# EAGLE design schematic_final (EAGLE 6.1)
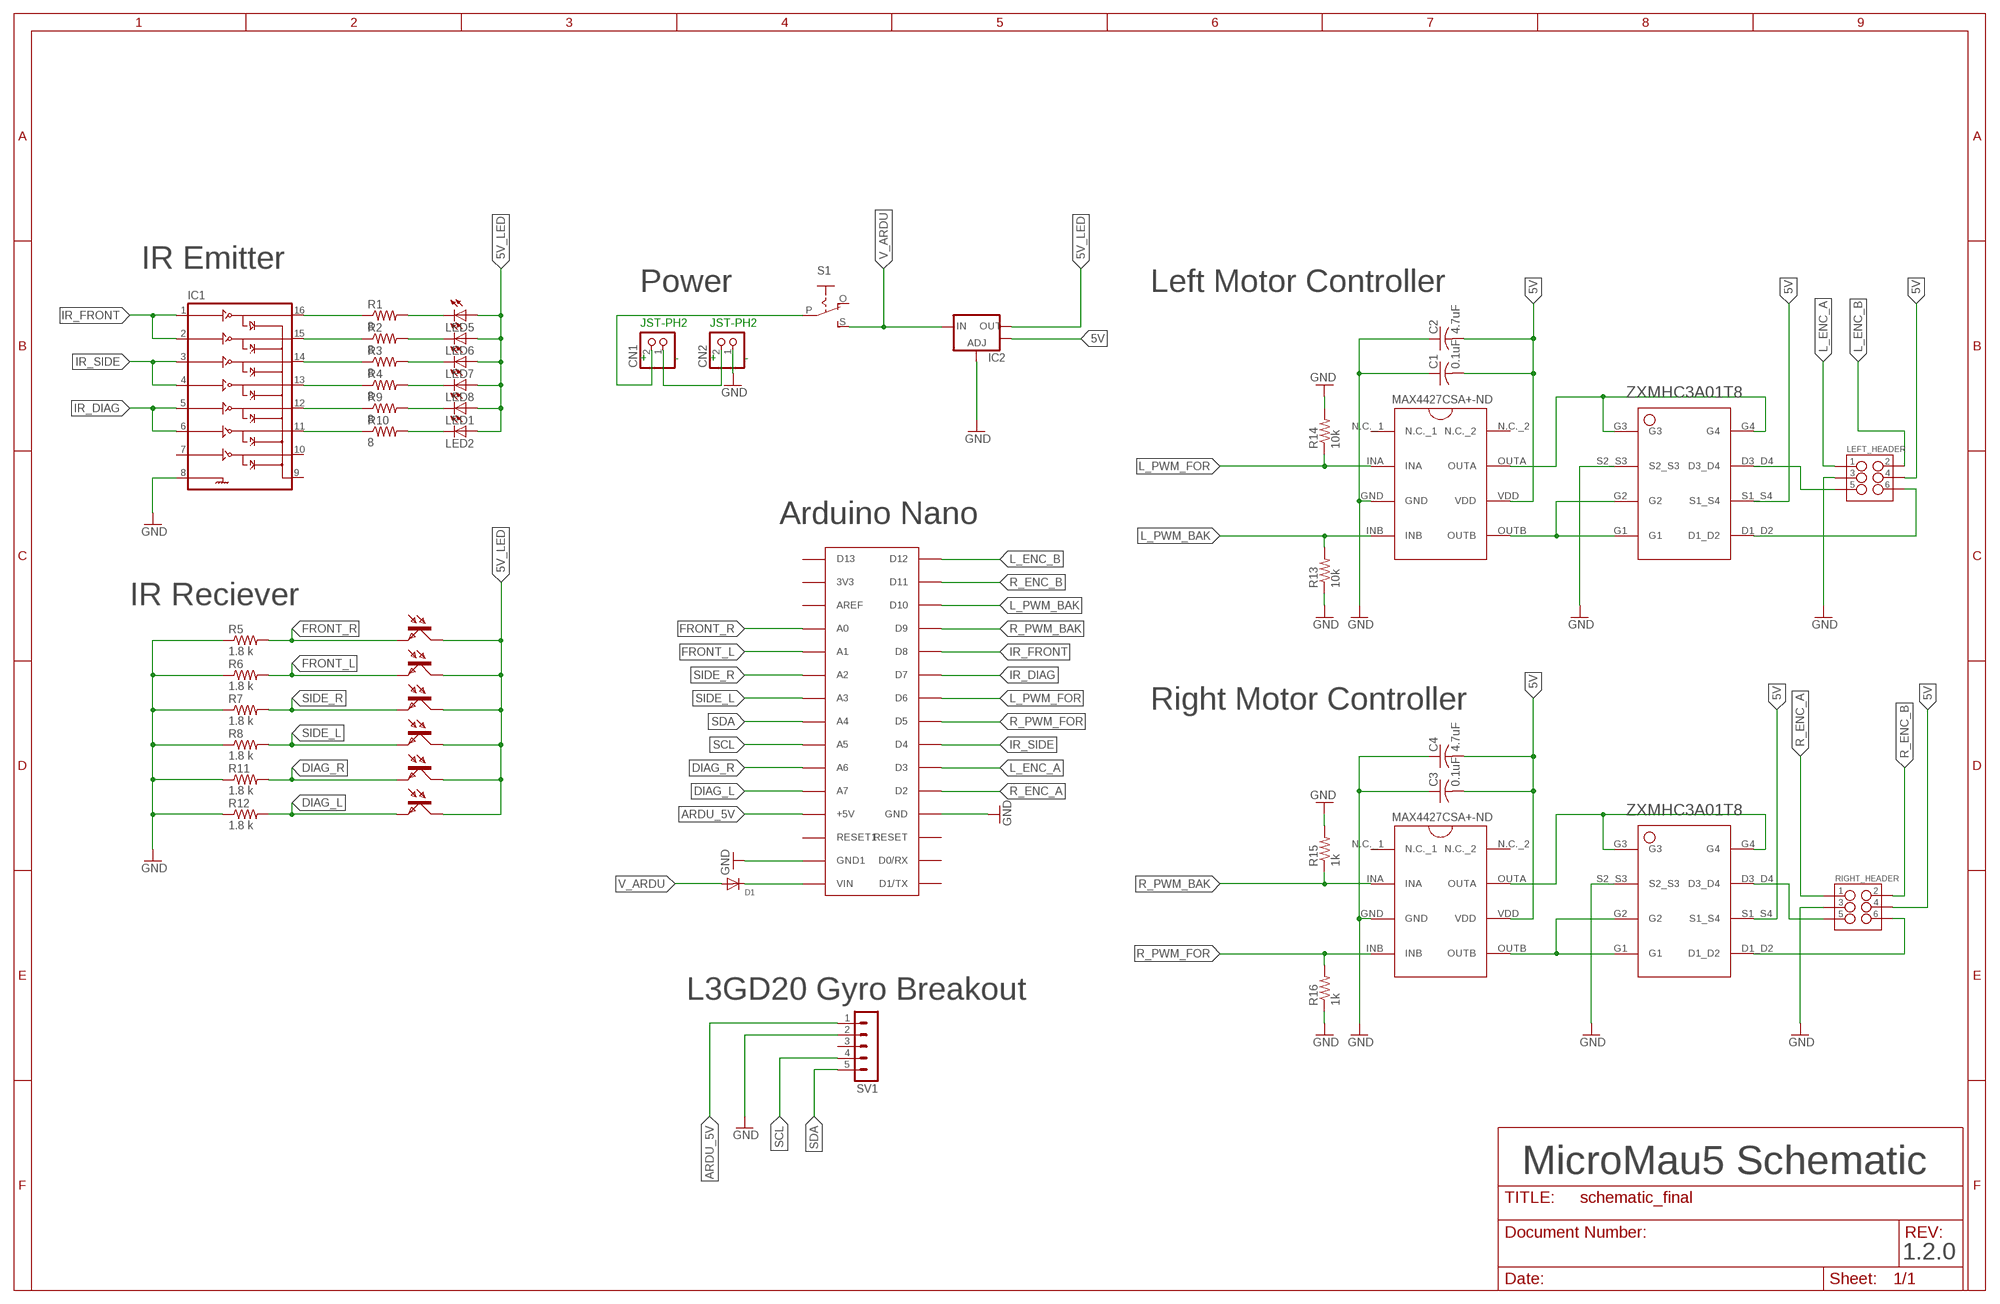
[diagram p0: schematic, sheet 1]

## Parts
C1  0.1uF  C-USC0805  [C0805]
C2  4.7uF  C-USC0805  [C0805]
C3  0.1uF  C-USC0805  [C0805]
C4  4.7uF  C-USC0805  [C0805]
CN1  JST_2PIN-THM  [JST-PH-2-THM]
CN2  JST_2PIN-THM  [JST-PH-2-THM]
D1  DIODESOD-123  [SOD-123]
IC1  IC_ULN2003-TSSOP-16  [TSSOP-16]
IC2  V_REG_LM1117SOT223  [SOT223]
LED1  LED5MM  [LED5MM]
LED2  LED5MM  [LED5MM]
LED5  LED5MM  [LED5MM]
LED6  LED5MM  [LED5MM]
LED7  LED5MM  [LED5MM]
LED8  LED5MM  [LED5MM]
LEFT_HEADER  M03X2SHROUD  [2X3-SHROUDED]
R1  8  R-US_M0805  [M0805]
R2  8  R-US_M0805  [M0805]
R3  8  R-US_M0805  [M0805]
R4  8  R-US_M0805  [M0805]
R5  1.8 k  R-US_R0805  [R0805]
R6  1.8 k  R-US_R0805  [R0805]
R7  1.8 k  R-US_R0805  [R0805]
R8  1.8 k  R-US_R0805  [R0805]
R9  8  R-US_M0805  [M0805]
R10  8  R-US_M0805  [M0805]
R11  1.8 k  R-US_R0805  [R0805]
R12  1.8 k  R-US_R0805  [R0805]
R13  10k  R-US_R0805  [R0805]
R14  10k  R-US_R0805  [R0805]
R15  1k  R-US_R0805  [R0805]
R16  1k  R-US_R0805  [R0805]
RIGHT_HEADER  M03X2SHROUD  [2X3-SHROUDED]
S1  EG1218S  [EG1218]
SV1  MA05-1  [MA05-1]
T1  BPX81  [BPX81]
T2  BPX81  [BPX81]
T3  BPX81  [BPX81]
T4  BPX81  [BPX81]
T5  BPX81  [BPX81]
T6  BPX81  [BPX81]
U$1  MAX4427CSA+-ND  [MAX4427CSA+-ND]
U$2  ZXMHC3A01T8  [ZXMHC3A01T8]
U$3  ARDUINONANO  [PDIP-32]
U$4  MAX4427CSA+-ND  [MAX4427CSA+-ND]
U$5  ZXMHC3A01T8  [ZXMHC3A01T8]

## Nets
5V [PWR]: C1.2 C2.2 C3.2 C4.2 IC2.4(OUT) LEFT_HEADER.4 RIGHT_HEADER.4 U$1.VDD U$2.S1_S4 U$4.VDD U$5.S1_S4
5V_LED [PWR]: IC2.2(OUT) LED1.A LED2.A LED5.A LED6.A LED7.A LED8.A T1.C T2.C T3.C T4.C T5.C T6.C
ARDU_5V: SV1.1 U$3.+5V
DIAG_L: R12.2 T6.E U$3.A7
DIAG_R: R11.2 T5.E U$3.A6
FRONT_L: R6.2 T3.E U$3.A1
FRONT_R: R5.2 T2.E U$3.A0
GND [PWR]: C1.1 C2.1 C3.1 C4.1 CN2.1 IC1.8(GND) IC2.1(ADJ) LEFT_HEADER.3 R5.1 R6.1 R7.1 R8.1 R11.1 R12.1 R13.1 R14.2 R15.2 R16.1 RIGHT_HEADER.3 SV1.2 U$1.GND U$2.S2_S3 U$3.GND U$3.GND1 U$4.GND U$5.S2_S3
IR_DIAG: IC1.5(5B) IC1.6(6B) U$3.D7
IR_FRONT: IC1.1(1B) IC1.2(2B) U$3.D8
IR_SIDE: IC1.3(3B) IC1.4(4B) U$3.D4
L_ENC_A: LEFT_HEADER.1 U$3.D3
L_ENC_B: LEFT_HEADER.2 U$3.D12
L_PWM_BAK: R13.2 U$1.INB U$3.D10
L_PWM_FOR: R14.1 U$1.INA U$3.D6
N$1: U$1.OUTB U$2.G1 U$2.G2
N$2: LEFT_HEADER.5 U$2.D3_D4
N$3: U$1.OUTA U$2.G3 U$2.G4
N$4: LEFT_HEADER.6 U$2.D1_D2
N$5 [v_batt]: CN1.1 CN2.2
N$6 [v_batt]: CN1.2 S1.P
N$7: U$4.OUTB U$5.G1 U$5.G2
N$8: U$4.OUTA U$5.G3 U$5.G4
N$9: RIGHT_HEADER.5 U$5.D3_D4
N$10: RIGHT_HEADER.6 U$5.D1_D2
N$11: IC1.16(1C) R1.1
N$12: IC1.15(2C) R2.1
N$13: IC1.14(3C) R3.1
N$14: IC1.13(4C) R4.1
N$15: LED5.K(C) R1.2
N$16: LED6.K(C) R2.2
N$17: LED7.K(C) R3.2
N$18: LED8.K(C) R4.2
N$19: IC1.12(5C) R9.1
N$20: IC1.11(6C) R10.1
N$21: LED1.K(C) R9.2
N$22: LED2.K(C) R10.2
N$23: D1.C U$3.VIN
R_ENC_A: RIGHT_HEADER.1 U$3.D2
R_ENC_B: RIGHT_HEADER.2 U$3.D11
R_PWM_BAK: R15.1 U$3.D9 U$4.INA
R_PWM_FOR: R16.2 U$3.D5 U$4.INB
SCL: SV1.4 U$3.A5
SDA: SV1.5 U$3.A4
SIDE_L: R8.2 T4.E U$3.A3
SIDE_R: R7.2 T1.E U$3.A2
V_ARDU [PWR]: D1.A IC2.3(IN) S1.S
Unconnected: IC1.7(7B) IC1.9(COM) IC1.10(7C) S1.O SV1.3 U$1.N.C._1 U$1.N.C._2 U$3.3V3 U$3.AREF U$3.D0/RX U$3.D1/TX U$3.D13 U$3.RESET U$3.RESET1 U$4.N.C._1 U$4.N.C._2

## Notes on the sheet
- IR Emitter
- Power | Left Motor Controller
- JST-PH2 | JST-PH2
- + | - | + | -
- Arduino Nano
- IR Reciever
- Right Motor Controller
- L3GD20 Gyro Breakout
- MicroMau5 Schematic
- 1.2.0

## Library data of the parts
C1-C4 = adafruit:C-US: CAPACITOR, American symbol
CN1 CN2 = adafruit:JST_2PIN: JST 2-Pin Connectors of various flavors SMT-RA (S2B-PH-SM4) 4UConnector #17311 SMT (B2B-PH-SM4) THM-RA (S2B-PH) THM (B2B-PH)
D1 = adafruit:DIODE: Diode SMADIODE - SMA Surface Mount Package 20V 1A Schottky Diode Digikey: 641-1014-6-ND DO-1N4148 - Through Hole Small Current Diode SOD-123 20V 1 A (.5mV Vf) Schottky Diode - Digikey: MBRX120TPMSCT-ND SOD-323 10V 570mA (.38mV Vf, 3ns) Schottky Diode - Digikey: ZLLS410CT-ND SOD-523 30V 30mA Schottky Diode (RB751S-40TE61) - Digikey: RB751S-40TE61CT-ND SOT23-R/W - SOT23 Package (R = Solder Paste/Reflow Ovens, W = Hand-Soldering) BAT54Film 40V 300mA - Digikey: 497-7162-1-ND
IC1 = dp_devices:IC_ULN2003: 7 Darlington Array Driver
IC2 = SparkFun-PowerIC:V_REG_LM1117: Voltage Regulator LM1117 Standard adjustable voltage regulator but in SMD form. Spark Fun Electronics SKU : COM-00595
LED1 LED2 LED5-LED8 = adafruit:LED: LED OSRAM: - CHIPLED LG R971, LG N971, LY N971, LG Q971, LY Q971, LO R971, LY R971 LH N974, LH R974 LS Q976, LO Q976, LY Q976 LO Q996 - Hyper CHIPLED LW Q18S LB Q993, LB Q99A, LB R99A - SideLED LS A670, LO A670, LY A670, LG A670, LP A670 LB A673, LV A673, LT A673, LW A673 LH A674 LY A675 LS A676, LA A676, LO A676, LY A676, LW A676 LS A679, LY A679, LG A679 - Hyper Micro SIDELED® LS Y876, LA Y876, LO Y876, LY Y876 LT Y87S - SmartLED LW L88C, LW L88S LB L89C, LB L89S, LG L890 LS L89K, LO L89K, LY L89K LS L896, LA L896, LO L896, LY L896 - TOPLED LS T670, LO T670, LY T670, LG T670, LP T670 LSG T670, LSP T670, LSY T670, LOP T670, LYG T670 LG T671, LOG T671, LSG T671 LB T673, LV T673, LT T673, LW T673 LH T674 LS T676, LA T676, LO T676, LY T676, LB T676, LH T676, LSB T676, LW T676 LB T67C, LV T67C, LT T67C, LS T67K, LO T67K, LY T67K, LW E67C LS E67B, LA E67B, LO E67B, LY E67B, LB E67C, LV E67C, LT E67C LW T67C LS T679, LY T679, LG T679 LS T770, LO T770, LY T770, LG T770, LP T770 LB T773, LV T773, LT T773, LW T773 LH T774 LS E675, LA E675, LY E675, LS T675 LS T776, LA T776, LO T776, LY T776, LB T776 LHGB T686 LT T68C, LB T68C - Hyper Mini TOPLED® LB M676 - Mini TOPLED Santana® LG M470 LS M47K, LO M47K, LY M47K Source: http://www.osram.convergy.de/
LEFT_HEADER RIGHT_HEADER = SparkFun-Connectors:M03X2: 2x3 .1" header. Shrouded, with keying- CONN-10681 SMT- CONN-11415 Pogo pins- HW-11044; PROD_ID: CONN-10681
R1-R16 = adafruit:R-US_: RESISTOR, American symbol
S1 = adafruit:EG1218: SLIDING SWITCH 0.1" spacing through hole, vertical SPDT slide switch http://www.ladyada.net/library/pcb/eaglelibrary.html
SV1 = con-lstb:MA05-1: PIN HEADER; OC_FARNELL: unknown; OC_NEWARK: unknown
T1-T6 = opto-trans-siemens:BPX81: PHOTO TRANSISTOR; OC_FARNELL: unknown; OC_NEWARK: unknown
U$1 U$4 = MAX4427CSA+-ND:MAX4427CSA+-ND
U$2 U$5 = ZXMHC3A01T8:ZXMHC3A01T8
U$3 = arduino_nano:ARDUINONANO: Arduino Nano V3.0 designed for female smd header S5641-ND

## Net classes
0 default: width 0.203 mm, drill 0.508 mm, clearance 0.203 mm
1 PWR: width 0.508 mm, drill 0.508 mm, clearance 0.203 mm
2 v_batt: width 1.27 mm, drill 0.508 mm, clearance 0.203 mm

## Board
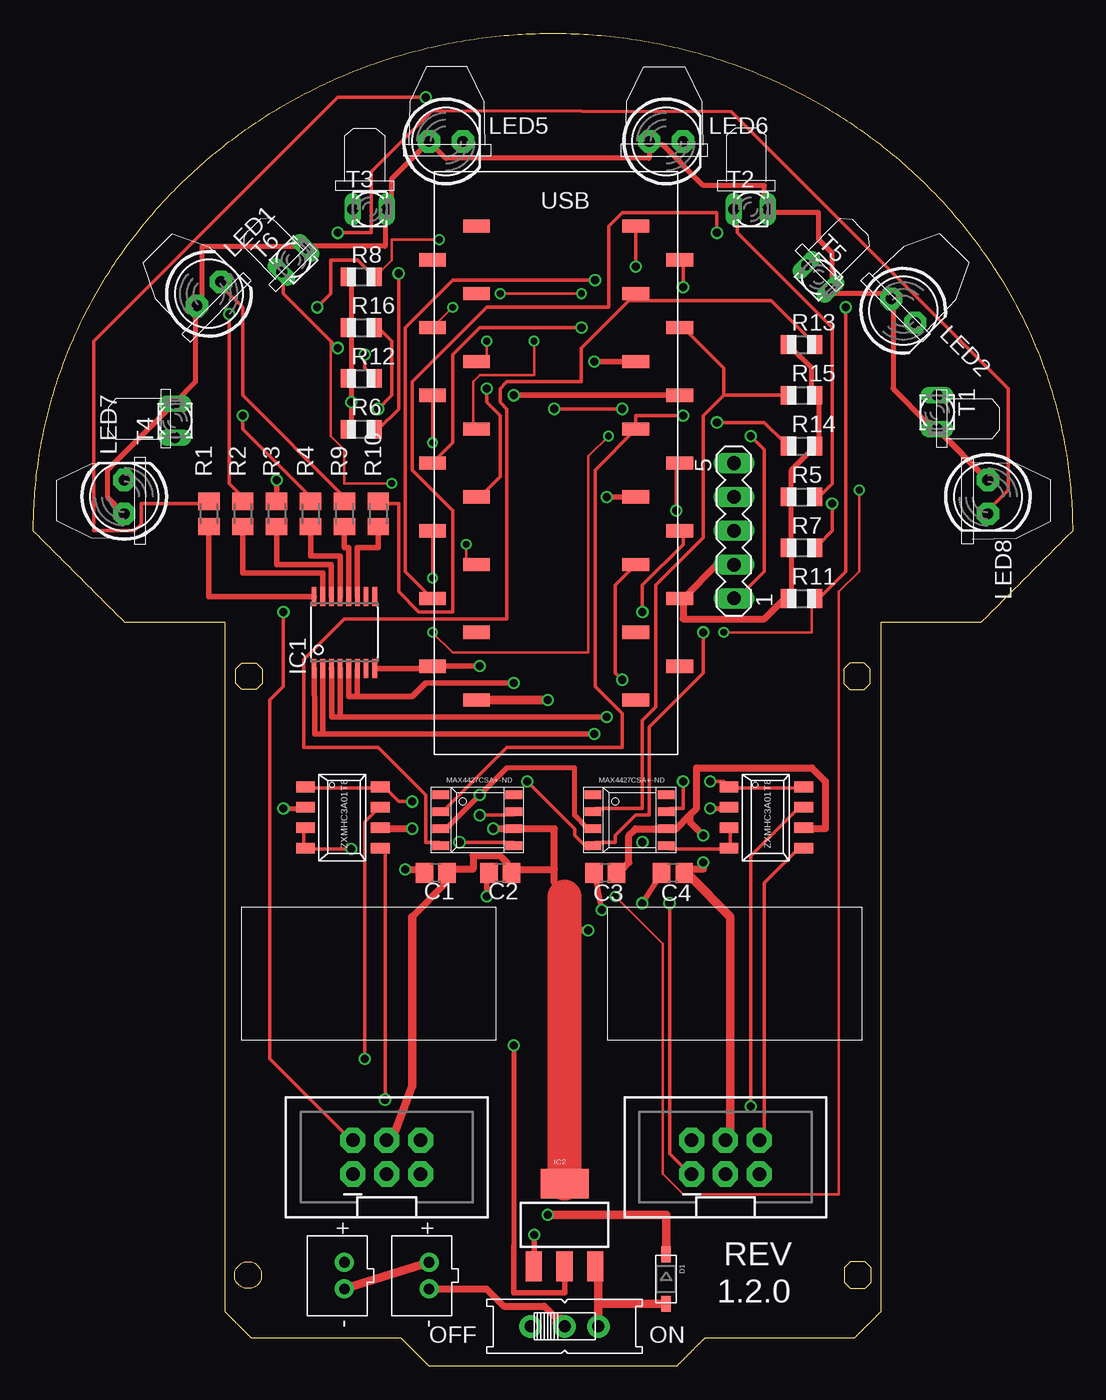
[diagram p1: board, top side]
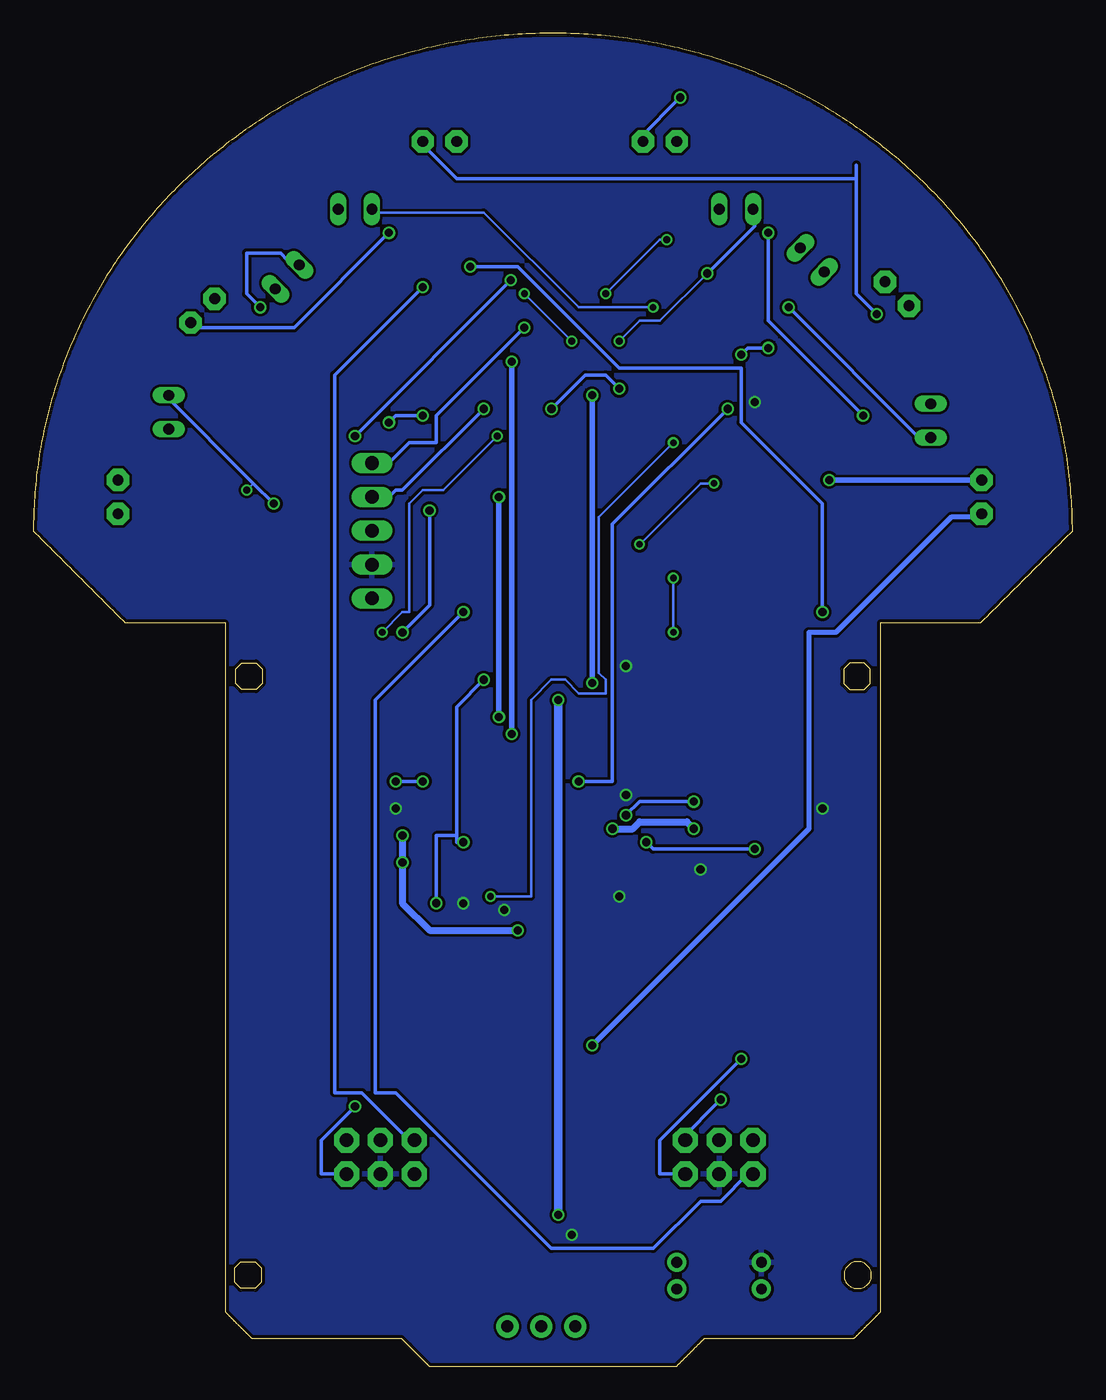
[diagram p2: board, bottom side, seen from below]

Size 77.93 x 99.99 mm. Coordinates in mm from the lower left corner, seen from the top.
Outline: 38.99,99.99 38.65,99.99 38.31,99.99 37.98,99.98 37.65,99.97 37.31,99.96 36.98,99.94 36.65,99.93 36.32,99.91 35.99,99.88 35.66,99.86 35.33,99.83 35,99.8 34.67,99.77 34.35,99.73 34.02,99.69 33.7,99.65 33.37,99.61 33.05,99.56 32.73,99.51 32.41,99.46 32.08,99.41 31.76,99.35 31.45,99.3 31.13,99.23 30.81,99.17 30.5,99.11 30.18,99.04 29.87,98.97 29.55,98.89 29.24,98.82 28.93,98.74 28.62,98.66 28.31,98.58 28,98.49 27.7,98.4 27.39,98.31 27.09,98.22 26.78,98.13 26.18,97.93 25.88,97.83 25.58,97.73 25.28,97.62 24.99,97.51 24.69,97.4 24.4,97.29 24.1,97.18 23.81,97.06 23.52,96.94 23.23,96.82 22.94,96.69 22.65,96.57 22.37,96.44 22.08,96.31 21.8,96.18 21.52,96.04 21.24,95.91 20.96,95.77 20.68,95.63 20.4,95.49 20.13,95.34 19.85,95.19 19.31,94.9 19.04,94.74 18.77,94.59 18.5,94.43 18.24,94.27 17.97,94.11 17.71,93.95 17.45,93.78 17.19,93.62 16.93,93.45 16.67,93.28 16.42,93.1 16.16,92.93 15.91,92.75 15.66,92.57 15.41,92.4 15.16,92.21 14.92,92.03 14.67,91.84 14.43,91.66 14.19,91.47 13.95,91.28 13.71,91.08 13.47,90.89 13.24,90.69 13,90.49 12.77,90.29 12.54,90.09 12.31,89.89 12.09,89.68 11.86,89.48 11.64,89.27 11.42,89.06 11.2,88.84 10.98,88.63 10.77,88.42 10.55,88.2 10.34,87.98 9.92,87.54 9.71,87.32 9.51,87.09 9.3,86.86 9.1,86.64 8.9,86.4 8.7,86.17 8.51,85.94 8.32,85.71 8.12,85.47 7.93,85.23 7.56,84.75 7.37,84.51 7.19,84.27 7.01,84.02 6.83,83.78 6.66,83.53 6.48,83.28 6.31,83.03 6.14,82.78 5.97,82.53 5.81,82.27 5.64,82.02 5.48,81.76 5.32,81.5 5.17,81.24 5.01,80.98 4.86,80.72 4.71,80.45 4.56,80.19 4.41,79.92 4.27,79.65 4.12,79.38 3.98,79.11 3.84,78.84 3.71,78.57 3.57,78.3 3.44,78.02 3.31,77.75 3.19,77.47 3.06,77.19 2.94,76.91 2.82,76.63 2.7,76.35 2.59,76.06 2.48,75.78 2.37,75.49 2.26,75.21 2.15,74.92 2.05,74.63 1.95,74.34 1.85,74.05 1.75,73.76 1.66,73.47 1.57,73.17 1.48,72.88 1.39,72.58 1.31,72.28 1.23,71.99 1.15,71.69 1.07,71.39 1,71.09 0.93,70.79 0.86,70.48 0.79,70.18 0.73,69.88 0.67,69.57 0.61,69.26 0.55,68.96 0.5,68.65 0.45,68.34 0.4,68.03 0.35,67.72 0.31,67.41 0.27,67.1 0.23,66.79 0.2,66.47 0.17,66.16 0.14,65.84 0.11,65.53 0.09,65.21 0.07,64.89 0.05,64.58 0.03,64.26 0.02,63.94 0.01,63.62 0,63.3 0,62.98 0,62.65 0.11,62.55 0.22,62.44 0.32,62.33 0.43,62.23 0.54,62.12 0.75,61.9 0.86,61.8 0.97,61.69 1.07,61.58 1.18,61.47 1.29,61.37 1.4,61.26 1.5,61.15 1.61,61.04 1.72,60.94 1.83,60.83 1.93,60.72 2.04,60.62 2.15,60.51 2.25,60.4 2.36,60.29 2.47,60.19 2.68,59.97 2.79,59.86 2.9,59.76 3.01,59.65 3.11,59.54 3.22,59.43 3.33,59.33 3.54,59.11 3.65,59 3.76,58.9 3.97,58.68 4.08,58.58 4.19,58.47 4.29,58.36 4.4,58.25 4.51,58.15 4.62,58.04 4.72,57.93 4.83,57.82 4.94,57.72 5.05,57.61 5.26,57.39 5.37,57.29 5.48,57.18 5.69,56.97 5.8,56.86 5.9,56.75 6.01,56.64 6.12,56.54 6.23,56.43 6.33,56.32 6.66,56 6.76,55.89 6.87,55.78 14.39,55.78 14.39,4.08 14.42,4.05 14.45,4.02 14.51,3.95 14.54,3.92 14.58,3.89 14.61,3.86 14.67,3.8 14.7,3.77 14.73,3.73 14.79,3.67 14.83,3.64 14.86,3.61 14.89,3.58 14.92,3.55 14.95,3.52 15.04,3.42 15.07,3.39 15.11,3.36 15.17,3.3 15.2,3.27 15.23,3.24 15.32,3.14 15.35,3.11 15.42,3.05 15.45,3.02 15.54,2.93 15.57,2.89 15.6,2.86 15.67,2.8 15.7,2.77 15.73,2.74 15.76,2.71 15.79,2.68 15.82,2.65 15.85,2.61 15.88,2.58 15.91,2.55 15.95,2.52 15.98,2.49 16.01,2.46 16.07,2.4 16.1,2.37 16.13,2.33 16.16,2.3 16.19,2.27 16.29,2.18 16.32,2.15 16.35,2.12 16.38,2.09 27.6,2.09 27.63,2.05 27.67,2.02 27.7,1.99 27.73,1.96 27.76,1.92 27.8,1.89 27.83,1.86 27.86,1.82 27.89,1.79 27.93,1.76 27.96,1.73 27.99,1.69 28.02,1.66 28.06,1.63 28.09,1.6 28.15,1.53 28.19,1.5 28.22,1.47 28.28,1.4 28.32,1.37 28.35,1.34 28.38,1.3 28.42,1.27 28.45,1.24 28.48,1.21 28.51,1.17 28.58,1.11 28.61,1.08 28.64,1.04 28.68,1.01 28.71,0.98 28.74,0.94 28.77,0.91 28.81,0.88 28.87,0.81 28.9,0.78 28.94,0.75 28.97,0.72 29,0.68 29.07,0.62 29.1,0.59 29.13,0.55 29.16,0.52 29.2,0.49 29.23,0.46 29.26,0.42 29.29,0.39 29.33,0.36 29.36,0.33 29.39,0.29 29.43,0.26 29.46,0.23 29.49,0.2 29.52,0.16 29.56,0.13 29.59,0.1 29.62,0.07 29.65,0.03 29.69,0 48.25,0 48.28,0.03 48.31,0.07 48.34,0.1 48.38,0.13 48.41,0.16 48.44,0.2 48.47,0.23 48.51,0.26 48.54,0.29 48.61,0.36 48.67,0.42 48.7,0.46 48.74,0.49 48.8,0.55 48.83,0.59 48.87,0.62 48.93,0.68 49,0.75 49.06,0.81 49.09,0.85 49.13,0.88 49.16,0.91 49.19,0.94 49.22,0.98 49.26,1.01 49.32,1.08 49.35,1.11 49.39,1.14 49.42,1.17 49.45,1.21 49.49,1.24 49.52,1.27 49.58,1.34 49.65,1.4 49.71,1.47 49.75,1.5 49.78,1.53 49.84,1.6 49.88,1.63 49.91,1.66 49.94,1.69 50.01,1.76 50.04,1.79 50.1,1.86 50.14,1.89 50.17,1.92 50.2,1.96 50.23,1.99 50.27,2.02 50.3,2.05 50.33,2.09 61.55,2.09 61.58,2.12 61.61,2.15 61.64,2.18 61.74,2.27 61.77,2.3 61.83,2.37 61.86,2.4 61.96,2.49 61.99,2.52 62.02,2.55 62.05,2.58 62.08,2.61 62.11,2.65 62.14,2.68 62.17,2.71 62.2,2.74 62.24,2.77 62.27,2.8 62.33,2.86 62.36,2.89 62.39,2.93 62.42,2.96 62.49,3.02 62.52,3.05 62.55,3.08 62.58,3.11 62.61,3.14 62.7,3.24 62.73,3.27 62.77,3.3 62.83,3.36 62.86,3.39 62.89,3.42 62.98,3.52 63.01,3.55 63.05,3.58 63.08,3.61 63.11,3.64 63.14,3.67 63.2,3.73 63.23,3.77 63.26,3.8 63.33,3.86 63.36,3.89 63.39,3.92 63.42,3.95 63.48,4.02 63.51,4.05 63.54,4.08 63.54,55.78 71.06,55.78 71.17,55.89 71.28,56 71.38,56.11 71.49,56.21 71.6,56.32 71.71,56.43 71.81,56.54 72.03,56.75 72.14,56.86 72.24,56.97 72.35,57.07 72.46,57.18 72.56,57.29 72.67,57.39 72.78,57.5 72.89,57.61 72.99,57.72 73.1,57.82 73.21,57.93 73.32,58.04 73.42,58.15 73.53,58.25 73.64,58.36 73.75,58.47 73.96,58.68 74.07,58.79 74.17,58.9 74.28,59 74.39,59.11 74.5,59.22 74.6,59.33 74.71,59.43 74.82,59.54 74.93,59.65 75.03,59.76 75.14,59.86 75.25,59.97 75.36,60.08 75.46,60.19 75.57,60.29 75.68,60.4 75.89,60.62 76,60.72 76.11,60.83 76.32,61.04 76.43,61.15 76.54,61.26 76.64,61.37 76.75,61.47 76.86,61.58 76.97,61.69 77.07,61.8 77.18,61.9 77.29,62.01 77.4,62.12 77.5,62.23 77.61,62.33 77.72,62.44 77.83,62.55 77.93,62.65 77.93,62.98 77.93,63.3 77.92,63.62 77.91,63.94 77.9,64.26 77.88,64.58 77.86,64.89 77.84,65.21 77.82,65.53 77.79,65.84 77.76,66.16 77.73,66.47 77.7,66.79 77.66,67.1 77.62,67.41 77.58,67.72 77.53,68.03 77.48,68.34 77.43,68.65 77.38,68.96 77.32,69.26 77.27,69.57 77.21,69.88 77.14,70.18 77.08,70.48 77.01,70.79 76.93,71.09 76.86,71.39 76.79,71.69 76.71,71.99 76.63,72.28 76.54,72.58 76.45,72.88 76.37,73.17 76.27,73.47 76.18,73.76 76.08,74.05 75.99,74.34 75.88,74.63 75.78,74.92 75.68,75.21 75.46,75.78 75.34,76.06 75.23,76.35 75.11,76.63 74.99,76.91 74.75,77.47 74.62,77.75 74.49,78.02 74.36,78.3 74.23,78.57 74.09,78.84 73.95,79.11 73.81,79.38 73.67,79.65 73.52,79.92 73.38,80.19 73.23,80.45 73.08,80.72 72.92,80.98 72.77,81.24 72.61,81.5 72.45,81.76 72.13,82.27 71.96,82.53 71.79,82.78 71.62,83.03 71.45,83.28 71.27,83.53 71.1,83.78 70.92,84.02 70.56,84.51 70.37,84.75 70.19,84.99 70,85.23 69.81,85.47 69.62,85.71 69.42,85.94 69.23,86.17 69.03,86.4 68.83,86.64 68.63,86.86 68.43,87.09 68.22,87.32 68.01,87.54 67.8,87.76 67.6,87.98 67.38,88.2 67.17,88.42 66.95,88.63 66.73,88.84 66.51,89.06 66.29,89.27 66.07,89.48 65.84,89.68 65.62,89.89 65.39,90.09 65.16,90.29 64.93,90.49 64.7,90.69 64.46,90.89 64.22,91.08 63.99,91.28 63.75,91.47 63.5,91.66 63.26,91.84 63.02,92.03 62.77,92.21 62.52,92.4 62.27,92.57 62.02,92.75 61.77,92.93 61.52,93.1 61.26,93.28 61,93.45 60.74,93.62 60.48,93.78 60.22,93.95 59.96,94.11 59.7,94.27 59.43,94.43 59.16,94.59 58.89,94.74 58.62,94.9 58.08,95.19 57.81,95.34 57.53,95.49 57.25,95.63 56.98,95.77 56.7,95.91 56.41,96.04 56.13,96.18 55.85,96.31 55.56,96.44 55.28,96.57 54.99,96.69 54.7,96.82 54.41,96.94 54.12,97.06 53.83,97.18 53.54,97.29 53.24,97.4 52.95,97.51 52.65,97.62 52.05,97.83 51.75,97.93 51.15,98.13 50.84,98.22 50.54,98.31 50.23,98.4 49.93,98.49 49.62,98.58 49.31,98.66 49,98.74 48.38,98.89 48.07,98.97 47.75,99.04 47.44,99.11 47.12,99.17 46.8,99.23 46.49,99.3 46.17,99.35 45.85,99.41 45.53,99.46 45.21,99.51 44.88,99.56 44.56,99.61 44.24,99.65 43.91,99.69 43.59,99.73 43.26,99.77 42.93,99.8 42.6,99.83 42.28,99.86 41.95,99.88 41.62,99.91 41.29,99.93 40.95,99.94 40.62,99.96 40.29,99.97 39.95,99.98 39.62,99.99 39.28,99.99 38.95,99.99
Outline: 17.16,51.21 16.72,50.76 15.61,50.76 15.16,51.21 15.16,52.31 15.61,52.76 16.72,52.76 17.16,52.31 17.16,51.21
Outline: 17.11,7.1 17.11,6.55 16.99,6.3 16.81,6.12 16.63,5.94 16.38,5.83 15.83,5.83 15.58,5.94 15.4,6.12 15.22,6.3 15.11,6.55 15.11,7.1 15.22,7.35 15.4,7.53 15.58,7.72 15.83,7.83 16.38,7.83 16.63,7.72 16.81,7.53 16.99,7.35 17.11,7.1
Outline: 60.77,51.21 61.22,50.76 62.32,50.76 62.77,51.21 62.77,52.31 62.32,52.76 61.22,52.76 60.77,52.31 60.77,51.21
Outline: 60.83,7.38 60.83,6.27 61.27,5.83 62.38,5.83 62.83,6.27 62.83,7.38 62.38,7.83 61.27,7.83 60.83,7.38
Copper layers (1*2*15*16): Top 0.035mm / dielectric 0.2mm / Route2 0.0175mm / dielectric 1.1mm / Route15 0.0175mm / dielectric 0.2mm / Bottom 0.035mm
Design rules: minimum track width 6mil, minimum drill 12mil, track to track 6mil, track to pad 6mil, pad to pad 6mil, via to via 6mil, smd to smd 0mil, copper to edge 10mil, drill to drill 10mil, minimum pad ring 6mil, minimum via ring 6mil, stop-mask expansion 2mil, vias tented up to drill 25mil, thermal gap 10mil

### Footprints (pad centres in the part's own frame; a part is rotated, then mirrored left to right if it is on the bottom)
C0805 = smd 1.3 x 1.5: 1 -0.85,0; 2 0.85,0
JST-PH-2-THM = drill 0.8 pad 1.422: 1 1,0; 2 -1,0
SOD-123 = smd 1.2 x 0.7: A 1.85,0; C -1.85,0
TSSOP-16 = smd 0.35 x 1.43: 1 -2.275,-2.7; 2 -1.625,-2.7; 3 -0.975,-2.7; 4 -0.325,-2.7; 5 0.325,-2.7; 6 0.975,-2.7; 7 1.625,-2.7; 8 2.275,-2.7; 9 2.275,2.7; 10 1.625,2.7; 11 0.975,2.7; 12 0.325,2.7; 13 -0.325,2.7; 14 -0.975,2.7; 15 -1.625,2.7; 16 -2.275,2.7
SOT223 = smd 1.219 x 2.235: 1 -2.311,-3.099; 2 0,-3.099; 3 2.311,-3.099 | smd 3.6 x 2.2: 4 0,3.099
LED5MM = drill 0.813 pad 1.676 octagon: A -1.27,0; K 1.27,0
2X3-SHROUDED = drill 1.016 pad 1.88 octagon: 1 -1.27,2.54; 2 1.27,2.54; 3 -1.27,0; 4 1.27,0; 5 -1.27,-2.54; 6 1.27,-2.54
M0805 = smd 1.3 x 1.6: 1 -0.95,0; 2 0.95,0
R0805 = smd 1.1 x 1.4: 1 -1,0; 2 1,0
EG1218 = drill 0.9 pad 1.676: O -2.54,0; P 0,0; S 2.54,0
MA05-1 = drill 1.016 long: 1 -5.08,0; 2 -2.54,0; 3 0,0; 4 2.54,0; 5 5.08,0
BPX81 = drill 0.813 long: C 1.27,0; E -1.27,0
MAX4427CSA+-ND = smd 1.27 x 0.635: GND -2.946,-0.762; INA -2.946,0.508; INB -2.946,-2.032; N.C._1 -2.946,1.778; N.C._2 2.54,1.778; OUTA 2.54,0.508; OUTB 2.54,-2.032; VDD 2.54,-0.762
ZXMHC3A01T8 = smd 1.4 x 0.8: D1_D2 2.695,-2.22; D3_D4 2.695,0.84; G1 -2.905,-2.22; G2 -2.905,-0.69; G3 -2.905,2.37; G4 2.695,2.37; S1_S4 2.695,-0.69; S2_S3 -2.905,0.84
PDIP-32 = smd 2.007 x 0.991: 3V3 16.891,-35.56; +5V 16.891,-10.16; A0 16.891,-30.48; A1 13.589,-27.94; A2 16.891,-25.4; A3 13.589,-22.86; A4 16.891,-20.32; A5 13.589,-17.78; A6 16.891,-15.24; A7 13.589,-12.7; AREF 13.589,-33.02; D0/RX -1.651,-5.08; D1/TX 1.651,-2.54; D2 1.651,-12.7; D3 -1.651,-15.24; D4 1.651,-17.78; D5 -1.651,-20.32; D6 1.651,-22.86; D7 -1.651,-25.4; D8 1.651,-27.94; D9 -1.651,-30.48; D10 1.651,-33.02; D11 -1.651,-35.56; D12 1.651,-38.1; D13 13.589,-38.1; GND -1.651,-10.16; GND1 16.891,-5.08; RESET 1.651,-7.62; RESET1 13.589,-7.62; VIN 13.589,-2.54

### Placement (x,y rotation side)
C1  30.18,37.02 0 top
C2  35.01,37.02 0 top
C3  42.88,37.02 0 top
C4  47.96,37.02 0 top
CN1  29.68,6.79 90 top
CN2  23.33,6.79 90 top
D1  47.46,6.54 270 top
IC1  23.33,55.05 0 top
IC2  39.84,10.6 0 top
LED1  13.17,80.45 45 top
LED2  65.24,79.18 315 top
LED5  30.95,91.88 0 top
LED6  47.46,91.88 0 top
LED7  6.82,65.21 90 top
LED8  71.59,65.21 270 top
LEFT_HEADER  26.5,15.68 90 top
R1  13.17,63.94 90 top
R2  15.71,63.94 90 top
R3  18.25,63.94 90 top
R4  20.79,63.94 90 top
R5  57.62,65.21 0 top
R6  24.6,70.29 0 top
R7  57.62,61.4 0 top
R8  24.6,81.72 0 top
R9  23.33,63.94 90 top
R10  25.87,63.94 90 top
R11  57.62,57.59 0 top
R12  24.6,74.1 0 top
R13  57.62,76.64 0 top
R14  57.62,69.02 0 top
R15  57.62,72.83 0 top
R16  24.6,77.91 0 top
RIGHT_HEADER  51.9,15.68 90 top
S1  39.84,2.98 0 top
SV1  52.54,62.67 90 top
T1  67.78,71.56 270 top
T2  53.81,86.8 0 top
T3  25.23,86.8 0 top
T4  10.63,70.93 90 top
T5  58.89,81.72 315 top
T6  19.52,82.99 45 top
U$1  33.49,41.08 0 top
U$2  23.33,41.08 0 top
U$3  46.82,47.43 180 top
U$4  44.92,41.08 0 top
U$5  55.08,41.08 0 top

### Tracks (layer width: path | path; a pad name or v marks a point on that pad's centre or on a via)
5V  (via drill 0.61)
  Top 0.381: 26.88,16.95 LEFT_HEADER.4
  Top 0.508: 52.28,16.95 RIGHT_HEADER.4 | 28.41,33.72 30.95,36.26 30.95,36.76 C1.2 31.45,37.27 32.98,37.27 32.98,38.29 35.01,38.29 35.52,37.78 35.52,37.27 C2.2 36.03,37.27 39.07,37.27 | v28.41,40.32 26.37,40.32 U$2.S1_S4 | v34.5,40.32 U$1.VDD 39.07,40.32 39.07,37.27 | 49.23,36.76 C4.2 49.23,37.27 50.25,37.27 v50.25,37.78 | C3.2 44.15,37.27 44.66,37.78 44.66,39.81 45.17,40.32 U$4.VDD 48.22,40.32 49.23,41.34 | 49.23,41.34 49.74,41.84 49.74,44.89 58.38,44.89 59.39,43.88 59.39,40.32 57.87,40.32 U$5.S1_S4 | v50.25,39.81 49.23,40.83 49.23,41.34 | 39.07,37.27 39.07,36.26 39.84,35.24 | v41.61,32.7 39.84,32.7
  Top 0.635: 26.88,16.95 28.41,21.02 28.41,33.72 | 52.28,16.95 52.28,33.72 49.23,36.76
  Top 2.54: IC2.4 39.84,32.7 39.84,35.24
  Bottom 0.508: v28.41,40.32 28.91,40.83 32.47,40.83 32.98,40.32 v34.5,40.32 | v50.25,39.81 v50.25,37.78 50.25,34.73 48.22,32.7 v41.61,32.7
5V_LED  (via drill 0.61)
  Top 0.381: 10.63,72.32 12.15,73.85 12.15,79.44 LED1.A 12.66,79.94 12.66,84.01 20.28,84.01 T6.C 20.79,84.01 26.37,84.01 26.37,86.55 T3.C 26.88,87.06 26.88,89.09 LED5.A 30.95,90.61 46.19,90.61 46.19,91.63 | 10.63,72.32 5.55,67.24 5.55,65.21 LED7.A | 46.19,91.63 47.2,91.63 50.25,88.58 54.82,88.58 54.82,87.06 T2.C 55.33,86.55 58.89,86.55 58.89,84.52 59.9,83.5 59.9,80.96 T5.C 59.9,80.45 63.97,80.45 LED2.A 64.47,79.94 64.47,73.34 67.01,70.8 | 10.63,72.32 T4.C | v36.03,24.06 36.03,9.01 36.03,8.82 | 40.09,7.81 IC2.2 | 46.19,91.63 LED6.A
  Top 0.406: 40.09,7.81 39.84,7.81 39.84,5.52 36.03,5.52 36.03,9.01 | 67.01,70.8 67.27,70.8 T1.C LED8.A
  Bottom 0.381: v36.03,24.06 19.77,40.32 19.77,55.05 17.74,55.05 9.1,63.69 7.07,63.69 LED7.A
ARDU_5V  (via drill 0.61)
  Top 0.254: U$3.+5V 27.9,59.62 27.9,77.91 31.45,81.47 v42.12,81.47 | v53.81,69.78 54.82,68.77 54.82,59.62 52.79,57.59 SV1.1
  Bottom 0.254: v53.81,69.78 v42.12,81.47
DIAG_L  (via drill 0.51, 0.61)
  Top 0.203: v32.47,61.66 32.47,60.64 32.98,60.13 U$3.A7 | v26.88,66.23 23.33,66.23 23.33,68.77 22.31,69.78 22.31,76.9
  Top 0.254: v24.85,75.88 24.85,74.86 25.36,74.36 R12.2 | v22.82,76.39 22.31,76.9 18.75,80.45 18.75,81.98 T6.E
  Bottom 0.203: v32.47,61.66 27.9,66.23 v26.88,66.23
  Bottom 0.254: v24.85,75.88 24.34,76.39 v22.82,76.39
DIAG_R  (via drill 0.51, 0.61)
  Top 0.203: v29.93,59.12 U$3.A6 | v29.93,55.05 31.45,53.53 41.61,53.53 41.61,68.26 v43.14,69.78 | v51.77,55.05 58.38,55.05 58.38,57.59 R11.2
  Top 0.254: v60.92,79.44 60.92,59.62 58.89,57.59 R11.2
  Bottom 0.203: v29.93,55.05 v29.93,59.12 | v43.14,69.78 47.2,65.72 48.73,65.72 49.74,64.7 49.74,56.58 50.25,56.58 v51.77,55.05
  Bottom 0.254: v60.92,79.44 61.93,80.45 61.93,83.5 59.39,83.5 58.89,82.99 58.38,82.99 T5.E
FRONT_L  (via drill 0.51, 0.61)
  Top 0.203: v33.99,76.9 33.99,75.88 33.49,75.37 U$3.A1
  Top 0.254: v27.39,81.98 27.39,71.82 25.87,70.29 R6.2
  Bottom 0.203: v33.99,76.9 32.47,78.42 30.95,78.42 v27.39,81.98
  Bottom 0.254: v27.39,81.98 23.83,85.53 23.83,86.55 T3.E
FRONT_R  (via drill 0.51)
  Top 0.203: v31.45,79.44 U$3.A0
  Top 0.254: R5.2 58.89,65.21 59.9,66.23 59.9,77.91 52.79,85.02 52.79,86.55 T2.E
  Bottom 0.203: v31.45,79.44 37.04,79.44 44.15,86.55 52.28,86.55 T2.E
GND  (via drill 0.6, 0.61)
  Top 0.381: R13.1 56.85,76.39 58.38,74.86 58.38,72.83 R15.2 58.89,72.83 58.89,69.28 R14.2 58.38,68.77 56.85,67.24 56.85,65.21 | 56.85,65.21 56.85,61.66 R7.1 56.85,61.15 56.85,57.59 R11.1 | 56.85,65.21 R5.1 | U$1.GND 30.95,40.32 v33.49,42.86 35.52,44.89 40.6,44.89 40.6,41.34 41.61,40.32 U$4.GND | R6.1 23.83,70.29 v23.83,72.32 23.83,73.85 R12.1 23.83,74.36 23.83,77.91 | 23.83,77.91 23.83,81.47 R8.1 | 23.83,77.91 R16.1 | v18.75,41.84 20.28,41.84 U$2.S2_S3 | v50.76,41.84 51.77,41.84 U$5.S2_S3 | 37.55,7.81 IC2.1
  Top 0.406: v33.49,52.51 U$3.GND1 29.93,52.35 IC1.8 | 42.12,36.76 v42.63,34.22 | C4.1 v45.68,34.73 | 33.99,36.76 v33.99,35.24 | 37.55,7.81 v37.55,9.84
  Top 0.508: v27.9,37.27 28.91,37.27 C1.1 | 33.99,36.76 C2.1 | 42.12,36.76 C3.1 | 48.73,57.59 51.27,60.13 SV1.2 | 48.73,57.59 48.73,56.07 54.82,56.07 56.35,57.59 R11.1 | 48.73,57.59 U$3.GND
  pour Bottom: -4.61,-0.83 80.48,-0.83 80.48,102.04 -4.61,102.04
IR_DIAG  (via drill 0.6)
  Top 0.254: 47.2,72.83 U$3.D7
  Top 0.406: IC1.5 23.64,50.23 24.28,50.23 | v36.03,72.83 47.2,72.83 47.46,72.83 | IC1.6 24.28,52.35 24.28,50.23 | 24.28,50.23 28.41,50.23 29.42,51.24 v36.03,51.24
  Bottom 0.406: v36.03,51.24 v36.03,72.83
IR_FRONT  (via drill 0.6)
  Top 0.406: 21.7,47.43 IC1.2 | IC1.1 21.1,48.23 21.1,47.43 21.7,47.43 | U$3.D8 v42.06,75.37 | v42.06,47.43 21.7,47.43
  Bottom 0.406: v42.06,75.37 v42.06,47.43
IR_SIDE  (via drill 0.6)
  Top 0.406: IC1.3 22.37,52.35 22.37,48.7 23.01,48.7 | 23.01,48.7 v43.01,48.7 | v43.01,65.21 U$3.D4 | IC1.4 23.01,48.7
  Bottom 0.406: v43.01,48.7 v43.01,65.21
L_ENC_A  (via drill 0.61)
  Top 0.254: v45.68,56.58 45.68,58.61 48.73,61.66 48.73,62.67 U$3.D3
  Bottom 0.254: v45.68,56.58 52.28,49.97 52.28,20.51 50.76,20.51 39.07,8.82 31.45,8.82 27.9,12.38 26.37,12.38 24.34,14.41 LEFT_HEADER.1
L_ENC_B  (via drill 0.61)
  Top 0.254: v18.75,56.58 18.75,50.99 17.74,49.97 17.74,23.05 23.83,16.95 LEFT_HEADER.2 | v45.17,82.48 U$3.D12
  Bottom 0.254: v18.75,56.58 18.75,64.7 24.85,70.8 24.85,74.86 33.99,74.86 41.61,82.48 v45.17,82.48
L_PWM_BAK
  Top 0.254: U$3.D10 44.66,79.94 | 44.66,79.94 41.11,76.39 41.11,73.85 35.52,73.85 35.01,73.34 35.01,72.32 35.52,71.82 35.52,56.07 23.33,56.07 20.28,53.02 20.28,46.42 25.87,46.42 29.42,42.86 29.42,39.3 30.44,39.3 U$1.INB | 44.66,79.94 55.33,79.94 58.38,76.9 R13.2
L_PWM_FOR  (via drill 0.61)
  Top 0.254: U$1.INA 30.95,41.84 35.52,46.42 44.15,46.42 44.15,48.96 42.12,50.99 42.12,67.24 U$3.D6 45.17,71.31 v48.73,71.31 | v51.27,70.8 54.82,70.8 56.35,69.28 R14.1
  Bottom 0.254: v51.27,70.8 50.76,71.31 v48.73,71.31
N$1  (via drill 0.61)
  Top 0.254: v31.96,39.3 36.03,39.3 U$1.OUTB | v23.83,38.8 20.79,38.8 U$2.G1 20.28,38.8 20.28,40.32 U$2.G2
  Bottom 0.254: v31.96,39.3 31.45,38.8 v23.83,38.8
N$2  (via drill 0.61)
  Top 0.254: v24.85,23.05 24.85,40.83 25.87,41.84 U$2.D3_D4
  Bottom 0.254: v24.85,23.05 30.95,16.95 30.95,14.41 LEFT_HEADER.5
N$3  (via drill 0.61)
  Top 0.254: v33.49,41.34 36.03,41.34 U$1.OUTA | v28.41,42.35 27.39,42.35 26.37,43.37 U$2.G4 25.87,43.37 20.79,43.37 U$2.G3
  Bottom 0.254: v33.49,41.34 32.47,42.35 v28.41,42.35
N$4  (via drill 0.61)
  Top 0.254: v26.37,20 26.37,38.8 U$2.D1_D2
  Bottom 0.254: v26.37,20 29.42,16.95 LEFT_HEADER.6
N$5
  Top 0.635: CN2.2 CN1.1
N$6
  Top 0.508: CN1.2 33.98,5.79 35.26,4.51 38.31,4.51 39.58,3.24
  Top 1.27: 39.58,3.24 S1.P
N$7
  Top 0.254: U$5.G2 52.28,40.32 52.28,38.8 U$5.G1 51.77,38.8 47.71,38.8 U$4.OUTB
N$8  (via drill 0.61)
  Top 0.254: v48.73,43.88 48.73,41.84 47.71,41.84 U$4.OUTA | v50.76,43.88 51.77,43.88 51.77,43.37 U$5.G3 52.28,43.37 57.36,43.37 U$5.G4
  Bottom 0.254: v50.76,43.88 v48.73,43.88
N$9  (via drill 0.61)
  Top 0.254: v53.81,19.49 53.81,38.29 57.36,41.84 U$5.D3_D4
  Bottom 0.254: v53.81,19.49 56.35,16.95 56.35,14.41 RIGHT_HEADER.5
N$10
  Top 0.254: U$5.D1_D2 57.36,38.8 54.82,36.26 54.82,16.95 RIGHT_HEADER.6
N$11
  Top 0.406: IC1.16 13.17,57.75 R1.1
N$12
  Top 0.406: R2.1 15.71,59.5 21.7,59.5 IC1.15
N$13
  Top 0.406: R3.1 18.25,60.13 22.35,60.13 IC1.14
N$14
  Top 0.406: R4.1 20.79,60.77 23,60.77 IC1.13
N$15  (via drill 0.61)
  Top 0.254: v29.42,95.18 22.82,95.18 4.53,76.9 4.53,62.67 7.58,62.67 8.09,63.18 8.09,64.7 13.17,64.7 R1.2
  Bottom 0.254: v29.42,95.18 32.47,92.14 LED5.K
N$16  (via drill 0.61)
  Top 0.254: v14.69,78.93 14.69,66.23 15.71,65.21 R2.2
  Bottom 0.254: v14.69,78.93 16.21,80.45 16.21,89.09 | 16.21,90.1 16.21,89.09 | LED6.K 48.73,91.63 46.19,89.09 16.21,89.09
N$17  (via drill 0.6)
  Top 0.406: R3.2 v18.25,66.48
  Bottom 0.406: v18.25,66.48 LED7.K
N$18  (via drill 0.61)
  Top 0.254: v15.71,71.31 15.71,70.29 20.79,65.21 R4.2 | v22.82,85.02 25.36,85.02 25.36,89.6 29.93,94.17 52.35,94.11 73.11,73.34 73.11,65.72 71.59,64.2 LED8.K
  Bottom 0.254: v15.71,71.31 22.82,78.42 v22.82,85.02
N$19
  Top 0.406: R9.1 23.33,61.4 23.65,61.4 IC1.12
N$20
  Top 0.406: R10.1 25.87,61.4 24.3,61.4 IC1.11
N$21
  Top 0.254: R9.2 23.33,65.21 15.71,72.83 15.71,79.44 14.18,80.96 LED1.K
N$22  (via drill 0.61)
  Top 0.254: v51.27,85.02 51.27,86.55 44.15,86.55 43.14,85.53 43.14,79.44 33.99,79.44 28.41,73.85 28.41,67.24 31.45,64.2 31.45,56.58 28.91,56.58 27.39,58.1 27.39,64.7 25.87,64.7 R10.2
  Bottom 0.254: v51.27,85.02 58.38,77.91 66,77.91 LED2.K
N$23  (via drill 0.6)
  Top 0.635: U$3.VIN v38.57,49.97 | D1.C 47.46,11.36 v38.57,11.36
  Bottom 0.635: v38.57,49.97 v38.57,11.36
R_ENC_A  (via drill 0.61)
  Top 0.254: U$3.D2 43.65,58.61 43.65,52 v44.15,51.5 | v47.71,34.73 47.71,15.94 49.23,14.41 RIGHT_HEADER.1
  Bottom 0.254: v44.15,51.5 46.19,49.46 46.19,39.81 | 46.19,39.81 46.19,39.3 v45.68,39.3 | v47.71,34.73 47.71,39.81 46.19,39.81
R_ENC_B  (via drill 0.61)
  Top 0.254: v48.73,80.96 48.73,82.99 U$3.D11
  Bottom 0.254: v48.73,80.96 55.33,74.36 55.33,20.51 53.3,20.51 49.74,16.95 RIGHT_HEADER.2
R_PWM_BAK
  Top 0.254: 51.77,72.83 50.25,71.31 50.25,62.16 46.69,58.61 46.69,49.46 45.68,48.45 45.68,41.84 42.12,41.84 U$4.INA | R15.1 51.77,72.83 | 51.77,72.83 51.77,74.86 48.73,77.91 U$3.D9
R_PWM_FOR  (via drill 0.61)
  Top 0.254: v50.25,55.05 50.25,52 46.19,47.94 46.19,41.34 45.17,41.34 43.65,39.81 43.65,39.3 42.12,39.3 U$4.INB 41.61,38.8 40.6,39.81 40.6,40.32 v37.04,43.88 | v48.22,64.2 48.22,67.75 U$3.D5 | v25.87,71.82 26.88,72.83 26.88,76.9 25.87,77.91 R16.2
  Bottom 0.254: v50.25,55.05 48.22,57.08 v48.22,64.2 | v25.87,71.82 34.5,63.18 34.5,43.88 v37.04,43.88
SCL  (via drill 0.61)
  Top 0.254: v33.99,73.34 33.99,72.32 35.01,71.31 35.01,66.74 33.49,65.21 U$3.A5 | v44.15,71.82 v39.07,71.82
  Bottom 0.254: v33.99,73.34 35.01,74.36 36.53,74.36 v39.07,71.82 | v44.15,71.82 50.25,65.72 50.76,65.72 51.27,65.21 SV1.4
SDA  (via drill 0.61)
  Top 0.254: U$3.A4 31.45,69.28 31.45,75.88 33.49,77.91 v41.11,77.91
  Bottom 0.254: v41.11,77.91 47.71,71.31 47.71,69.28 49.74,69.28 51.27,67.75 SV1.5
SIDE_L  (via drill 0.51, 0.61)
  Top 0.203: v37.55,76.9 37.55,74.36 33.49,74.36 32.98,73.85 32.98,70.29 U$3.A3 | v35.01,80.45 v41.11,80.45 | v30.44,84.52 26.88,84.52 26.88,82.99 25.87,81.98 R8.2
  Top 0.254: v21.29,79.44 22.31,80.45 22.31,82.99 24.34,82.99 25.36,81.98 R8.2
  Bottom 0.203: v41.11,80.45 v37.55,76.9 | v35.01,80.45 30.95,84.52 v30.44,84.52
  Bottom 0.254: v21.29,79.44 11.64,69.78 10.63,69.78 T4.E
SIDE_R  (via drill 0.51, 0.61)
  Top 0.203: v29.93,69.28 U$3.A2 | v43.65,35.24 47.2,31.68 47.2,14.41 48.73,12.89 60.41,12.89 60.41,58.1 61.93,59.62 v61.93,65.72
  Top 0.254: v59.9,64.7 59.9,62.67 58.89,61.66 R7.2
  Bottom 0.203: v29.93,69.28 35.52,63.69 35.52,52 35.01,51.5 35.01,50.48 37.04,50.48 38.06,51.5 39.07,51.5 40.6,49.97 40.6,35.24 v43.65,35.24 | 61.43,66.23 v61.93,65.72
  Bottom 0.254: v59.9,64.7 61.43,66.23 68.03,72.83 T1.E
V_ARDU
  Top 0.406: IC2.3 42.38,7.5
  Top 0.635: 42.38,7.5 42.38,4.69 | D1.A 42.38,4.69 | 42.38,4.69 S1.S

### Text on the board
tPlace: REV | 1.2.0 | OFF | ON